# EAGLE design PANOBOT_MAIN_V2 (EAGLE 8.6.3)
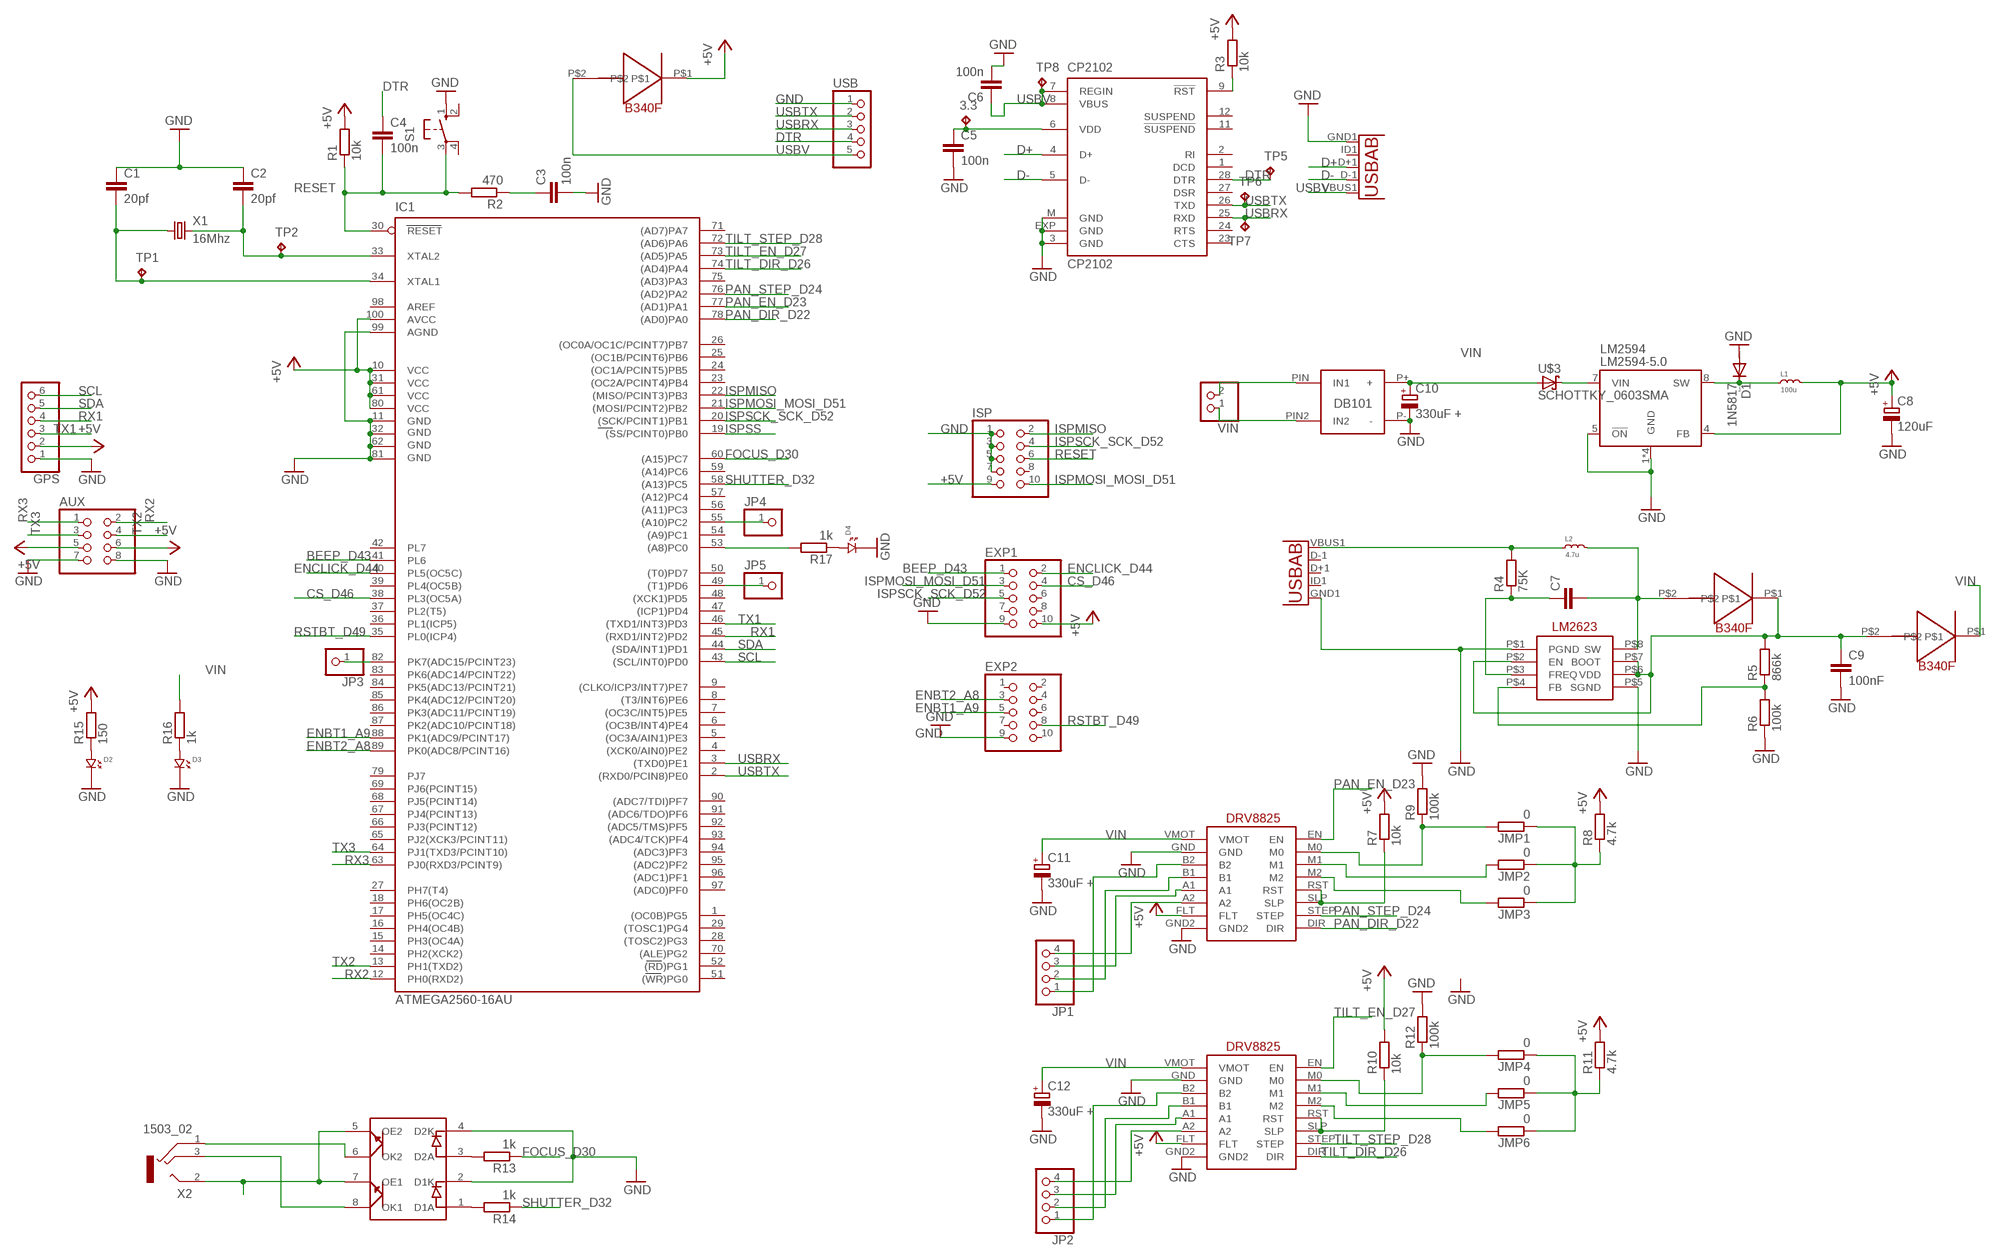
[diagram p0: schematic, sheet 1]

## Parts
3.3  TPTP16R  [TP16R]
AUX  PINHD-2X4  [2X04]
C1  20pf  C-EUC0603K  [C0603K]
C2  20pf  C-EUC0603K  [C0603K]
C3  100n  C-EUC0805  [C0805]
C4  100n  C-EUC0805  [C0805]
C5  100n  C-EUC0805  [C0805]
C6  100n  C-EUC0805  [C0805]
C7  C-EUC0603  [C0603]
C8  120uF  CPOL-EU153CLV-0605  [153CLV-0605]
C9  100nF  C-EU025-030X050  [C025-030X050]
C10  330uF +  CPOL-EUSANYO_F13  [SANYO-OSCON_F13]
C11  330uF +  CPOL-EUSANYO_F13  [SANYO-OSCON_F13]
C12  330uF +  CPOL-EUSANYO_F13  [SANYO-OSCON_F13]
CP2102  CP2102  [MLP28]
D1  1N5817  1N4942  [DO41-10]
D2  LED.0805  [0805.LED]
D3  LED.0805  [0805.LED]
D4  LED.0805  [0805.LED]
EXP1  PINHD-2X5  [2X05]
EXP2  PINHD-2X5  [2X05]
GPS  PINHD-1X6  [1X06]
IC1  ATMEGA2560-16AU  [TQFP100]
ISP  PINHD-2X5  [2X05]
JMP1  0  R-EU_R0805  [R0805]
JMP2  0  R-EU_R0805  [R0805]
JMP3  0  R-EU_R0805  [R0805]
JMP4  0  R-EU_R0805  [R0805]
JMP5  0  R-EU_R0805  [R0805]
JMP6  0  R-EU_R0805  [R0805]
JP1  PINHD-1X4  [1X04]
JP2  PINHD-1X4  [1X04]
JP3  PINHD-1X1  [1X01]
JP4  PINHD-1X1  [1X01]
JP5  PINHD-1X1  [1X01]
L1  100u  RF-INDUCTOR.HP100  [HPINDUCTOR100]
L2  4.7u  RF-INDUCTOR  [HPINDUCOR]
LM2594  LM2594-5.0  [SO08]
LM2623  LM2623  [MINI-SO-8]
R1  10k  R-EU_R0805  [R0805]
R2  470  R-EU_R0805  [R0805]
R3  10k  R-EU_R0805  [R0805]
R4  75K  R-EU_R0805  [R0805]
R5  866k  R-EU_R0805  [R0805]
R6  100k  R-EU_R0805  [R0805]
R7  10k  R-EU_R0805  [R0805]
R8  4.7k  R-EU_R0805  [R0805]
R9  100k  R-EU_R0805  [R0805]
R10  10k  R-EU_R0805  [R0805]
R11  4.7k  R-EU_R0805  [R0805]
R12  100k  R-EU_R0805  [R0805]
R13  1k  R-EU_R0805  [R0805]
R14  1k  R-EU_R0805  [R0805]
R15  150  R-EU_R0805  [R0805]
R16  1k  R-EU_R0805  [R0805]
R17  1k  R-EU_R0805  [R0805]
S1  10-XX  [B3F-10XX]
TP1  TPTP16R  [TP16R]
TP2  TPTP16R  [TP16R]
TP5  TPTP16R  [TP16R]
TP6  TPTP16R  [TP16R]
TP7  TPTP16R  [TP16R]
TP8  TPTP16R  [TP16R]
U1  USB""  [USB-MICRO-SMD]
U2  USB""  [USB-MICRO-SMD]
U$1  B340FSCHOTTKY  [SMC]
U$2  DB101_BRUECKENGLEICHRICHTER  [DB101_PACK]
U$3  SCHOTTKY_0603SMA  [SMA]
U$4  B340FSCHOTTKY  [SMC]
U$5  B340FSCHOTTKY  [SMC]
U$6  DRV8825  [DRV8825POLULOU]
U$7  DRV8825  [DRV8825POLULOU]
U$8  LTV827SMD8  [SMD8]
USB  PINHD-1X5  [1X05]
VIN  PINHD-1X2  [1X02]
X1  16Mhz  CRYSTALS-NOGND-4-HSMX  [HC49-4-HSMX]
X2  1503_02  [1503_02]

## Nets
+5V: AUX.5 AUX.6 C8.+ EXP1.10 GPS.2 IC1.10(VCC) IC1.31(VCC1) IC1.61(VCC2) IC1.80(VCC3) IC1.100(AVCC) ISP.9 L1.P$2 LM2594.4(FB) R1.2 R3.2 R7.2 R8.2 R10.2 R11.2 R15.2 U$1.P$1 U$6.FLT U$7.FLT
+5VUSBPWR: L2.P$1 R4.2 U2.VBUS1(VBUS)
BEEP_D43: EXP1.1 IC1.41(PL6)
CS_D46: EXP1.4 IC1.38(PL3(OC5A))
D+: CP2102.4(D+) U1.D+1(D+)
D-: CP2102.5(D-) U1.D-1(D-)
DTR: C4.1 CP2102.28(DTR) TP5.TP USB.4
ENBT1_A9: EXP2.5 IC1.88(PK1(ADC9/PCINT17))
ENBT2_A8: EXP2.3 IC1.89(PK0(ADC8/PCINT16))
ENCLICK_D44: EXP1.2 IC1.40(PL5(OC5C))
FOCUS_D30: IC1.60((A15)PC7) R13.1
GND: AUX.7 AUX.8 C1.1 C2.1 C3.2 C5.2 C6.2 C8.- C9.2 C10.- C11.- C12.- CP2102.3(GND) CP2102.EXP(GND) CP2102.M(GND) D1.A D2.P$2 D3.P$2 D4.P$2 EXP1.9 EXP2.9 GPS.1 IC1.11(GND) IC1.32(GND1) IC1.62(GND2) IC1.81(GND3) IC1.99(AGND) ISP.1 ISP.3 ISP.5 ISP.7 LM2594.1(GND) LM2594.2(GND) LM2594.3(GND) LM2594.5(!ON!) LM2594.6(GND) LM2623.P$1(PGND) LM2623.P$5(SGND) R6.1 R9.2 R12.2 S1.1(S) U1.GND1(GND) U2.GND1(GND) U$2.P-(-) U$6.GND U$6.GND2 U$7.GND U$7.GND2 U$8.2(D1K) U$8.4(D2K) USB.1
ISPMISO: IC1.22((MISO/PCINT3)PB3) ISP.2
ISPMOSI_MOSI_D51: EXP1.3 IC1.21((MOSI/PCINT2)PB2) ISP.10
ISPSCK_SCK_D52: EXP1.5 IC1.20((SCK/PCINT1)PB1) ISP.4
ISPSS: IC1.19((SS/PCINT0)PB0)
N$1: 3.3.TP C5.1 CP2102.6(VDD)
N$2: CP2102.9(!RST) R3.1
N$3: C3.1 R2.1
N$4: LM2623.P$4(FB) R5.1 R6.2
N$6: C7.1 LM2623.P$3(FREQ) R4.1
N$7: D1.C L1.P$1 LM2594.8(SW)
N$8: JMP1.2 R9.1 U$6.M0
N$9: C7.2 L2.P$2 LM2623.P$8(SW) U$4.P$2
N$10: JMP2.2 U$6.M1
N$11: C9.1 LM2623.P$2(EN) LM2623.P$6(VDD) LM2623.P$7(BOOT) R5.2 U$4.P$1 U$5.P$2
N$12: JMP3.2 U$6.M2
N$13: JMP1.1 JMP2.1 JMP3.1 R8.1
N$14: JP1.1 U$6.B2
N$15: JP1.2 U$6.B1
N$16: JP1.3 U$6.A1
N$17: JP1.4 U$6.A2
N$19: JMP4.2 R12.1 U$7.M0
N$20: JMP5.2 U$7.M1
N$21: JMP6.2 U$7.M2
N$22: JMP4.1 JMP5.1 JMP6.1 R11.1
N$23: JP2.1 U$7.B2
N$24: JP2.2 U$7.B1
N$25: JP2.3 U$7.A1
N$26: JP2.4 U$7.A2
N$27: R13.2 U$8.3(D2A)
N$28: R14.2 U$8.1(D1A)
N$29: U$8.6(OK2) X2.1
N$30: U$8.8(OK1) X2.3
N$31: U$8.5(OE2) U$8.7(OE1) X2.2
N$32: U$2.PIN(IN1) VIN.2
N$33: U$2.PIN2(IN2) VIN.1
N$34: IC1.82(PK7(ADC15/PCINT23)) JP3.1
N$35: IC1.55((A10)PC2) JP4.1
N$36: IC1.49((T1)PD6) JP5.1
N$37: D2.P$1 R15.1
N$38: D3.P$1 R16.1
N$39: D4.P$1 R17.1
N$40: IC1.53((A8)PC0) R17.2
N$41: LM2594.7(VIN) U$3.P$1(C)
PAN_DIR_D22: IC1.78((AD0)PA0) U$6.DIR
PAN_EN_D23: IC1.77((AD1)PA1) U$6.EN
PAN_STEP_D24: IC1.76((AD2)PA2) U$6.STEP
RESET: C4.2 IC1.30(RESET) ISP.6 R1.1 R2.2 S1.3(P)
RESET1: R7.1 U$6.RST U$6.SLP
RESET2: R10.1 U$7.RST U$7.SLP
RSTBT_D49: EXP2.8 IC1.35(PL0(ICP4))
RX1: GPS.4 IC1.45((RXD1/INT2)PD2)
RX2: AUX.2 IC1.12(PH0(RXD2))
RX3: AUX.1 IC1.63(PJ0(RXD3/PCINT9))
SCL: GPS.6 IC1.43((SCL/INT0)PD0)
SDA: GPS.5 IC1.44((SDA/INT1)PD1)
SHUTTER_D32: IC1.58((A13)PC5) R14.1
TILT_DIR_D26: IC1.74((AD4)PA4) U$7.DIR
TILT_EN_D27: IC1.73((AD5)PA5) U$7.EN
TILT_STEP_D28: IC1.72((AD6)PA6) U$7.STEP
TX1: GPS.3 IC1.46((TXD1/INT3)PD3)
TX2: AUX.4 IC1.13(PH1(TXD2))
TX3: AUX.3 IC1.64(PJ1(TXD3/PCINT10))
USBRX: CP2102.25(RXD) IC1.3((TXD0)PE1) TP7.TP USB.3
USBTX: CP2102.26(TXD) IC1.2((RXD0/PCIN8)PE0) TP6.TP USB.2
USBV: C6.1 CP2102.7(REGIN) CP2102.8(VBUS) TP8.TP U1.VBUS1(VBUS) U$1.P$2 USB.5
VIN: C10.+ C11.+ C12.+ R16.2 U$2.P+(+) U$3.P$2(A) U$5.P$1 U$6.VMOT U$7.VMOT
XTAL1: C1.2 IC1.34(XTAL1) TP1.TP X1.1
XTAL2: C2.2 IC1.33(XTAL2) TP2.TP X1.2
Unconnected: CP2102.1(DCD) CP2102.2(RI) CP2102.11(!SUSPEND) CP2102.12(SUSPEND) CP2102.23(CTS) CP2102.24(RTS) CP2102.27(DSR) EXP1.6 EXP1.7 EXP1.8 EXP2.1 EXP2.2 EXP2.4 EXP2.6 EXP2.7 EXP2.10 IC1.1((OC0B)PG5) IC1.4((XCK0/AIN0)PE2) IC1.5((OC3A/AIN1)PE3) IC1.6((OC3B/INT4)PE4) IC1.7((OC3C/INT5)PE5) IC1.8((T3/INT6)PE6) IC1.9((CLKO/ICP3/INT7)PE7) IC1.14(PH2(XCK2)) IC1.15(PH3(OC4A)) IC1.16(PH4(OC4B)) IC1.17(PH5(OC4C)) IC1.18(PH6(OC2B)) IC1.23((OC2A/PCINT4)PB4) IC1.24((OC1A/PCINT5)PB5) IC1.25((OC1B/PCINT6)PB6) IC1.26((OC0A/OC1C/PCINT7)PB7) IC1.27(PH7(T4)) IC1.28((TOSC2)PG3) IC1.29((TOSC1)PG4) IC1.36(PL1(ICP5)) IC1.37(PL2(T5)) IC1.39(PL4(OC5B)) IC1.42(PL7) IC1.47((ICP1)PD4) IC1.48((XCK1)PD5) IC1.50((T0)PD7) IC1.51((WR)PG0) IC1.52((RD)PG1) IC1.54((A9)PC1) IC1.56((A11)PC3) IC1.57((A12)PC4) IC1.59((A14)PC6) IC1.65(PJ2(XCK3/PCINT11)) IC1.66(PJ3(PCINT12)) IC1.67(PJ4(PCINT13)) IC1.68(PJ5(PCINT14)) IC1.69(PJ6(PCINT15)) IC1.70((ALE)PG2) IC1.71((AD7)PA7) IC1.75((AD3)PA3) IC1.79(PJ7) IC1.83(PK6(ADC14/PCINT22)) IC1.84(PK5(ADC13/PCINT21)) IC1.85(PK4(ADC12/PCINT20)) IC1.86(PK3(ADC11/PCINT19)) IC1.87(PK2(ADC10/PCINT18)) IC1.90((ADC7/TDI)PF7) IC1.91((ADC6/TDO)PF6) IC1.92((ADC5/TMS)PF5) IC1.93((ADC4/TCK)PF4) IC1.94((ADC3)PF3) IC1.95((ADC2)PF2) IC1.96((ADC1)PF1) IC1.97((ADC0)PF0) IC1.98(AREF) ISP.8 S1.2(S1) S1.4(P1) U1.ID1(USBID) U2.D+1(D+) U2.D-1(D-) U2.ID1(USBID) X2.2@2

## Library data of the parts
3.3 TP1 TP2 TP5-TP8 = testpad:TP: Test pad
AUX = pinhead:PINHD-2X4: PIN HEADER
C1-C7 C9 = rcl:C-EU: CAPACITOR, European symbol; SPICEPREFIX: C
C8 C10-C12 = rcl:CPOL-EU: POLARIZED CAPACITOR, European symbol; SPICEPREFIX: C
CP2102 = silabs:CP210*: Single-Chip USB to UART Bridge Source: www.silabs.com .. CP2101.pdf / cp2102.pdf; MF: FARNELL; MPN: CP2102-GM; OC_FARNELL: 9282130; OC_NEWARK: 30K5635
D1 = diode:1N4942: DIODE 1.0 A, 200 V, 150 ns
D2-D4 = standardparts:LED
EXP1 EXP2 ISP = pinhead:PINHD-2X5: PIN HEADER
GPS = pinhead:PINHD-1X6: PIN HEADER
IC1 = atmel-2005:ATMEGA*: MICROCONTROLLER 64/128/256 Kbytes FLASH 4 Kbytes EEPROM 8 Kbytes SRAM 86 General Purpose I/O pins 12-channels16-bit PWM 4 x Serial USARTs 16-channels 10-bit A/D
JMP1-JMP6 R1-R17 = rcl:R-EU_: RESISTOR, European symbol; SPICEPREFIX: R
JP1 JP2 = pinhead:PINHD-1X4: PIN HEADER
JP3-JP5 = pinhead:PINHD-1X1: PIN HEADER
L1 L2 = standardparts:RF-INDUCTOR
LM2594 = we-power:LM2594: TI LM2594 Step-Down (150kHz, 0.5A, 4.5-45V input)
LM2623 = 00_eigene:LM2623
S1 = switch-omron:10-XX: OMRON SWITCH; MPN: B3F-1000; OC_FARNELL: 176432; OC_NEWARK: 36M3542
U1 U2 = MicroUSB:USB: This is a USB AB connector that is compatible with USB OTG. i.e. this connector can serve as a host or device
U$1 U$4 U$5 = 00_eigene:B340FSCHOTTKY
U$2 = 00_eigene:DB101_BRUECKENGLEICHRICHTER
U$3 = 00_eigene:SCHOTTKY_0603
U$6 U$7 = 00_eigene:DRV8825
U$8 = 00_eigene:LTV827; SPICEPREFIX: X
USB = pinhead:PINHD-1X5: PIN HEADER
VIN = pinhead:PINHD-1X2: PIN HEADER
X1 = IQD-Frequency-Products:CRYSTALS-NOGND: CRYSTALS CAN NOT GROUNDED
X2 = con-lumberg:1503_02: Jack connectors according to JISC 6560, 3.5 mm Klinkeneinbaukupplung nach JISC 6560, 3,5 mm, 3-polig/stereo, abgewinkelte Ausführung, Surface-Mount-Technik (SMT) Source: http://www.lumberg.com/Produkte/PDFs/1503_02.pdf; OC_FARNELL: 1216979; OC_NEWARK: unknown

## Board
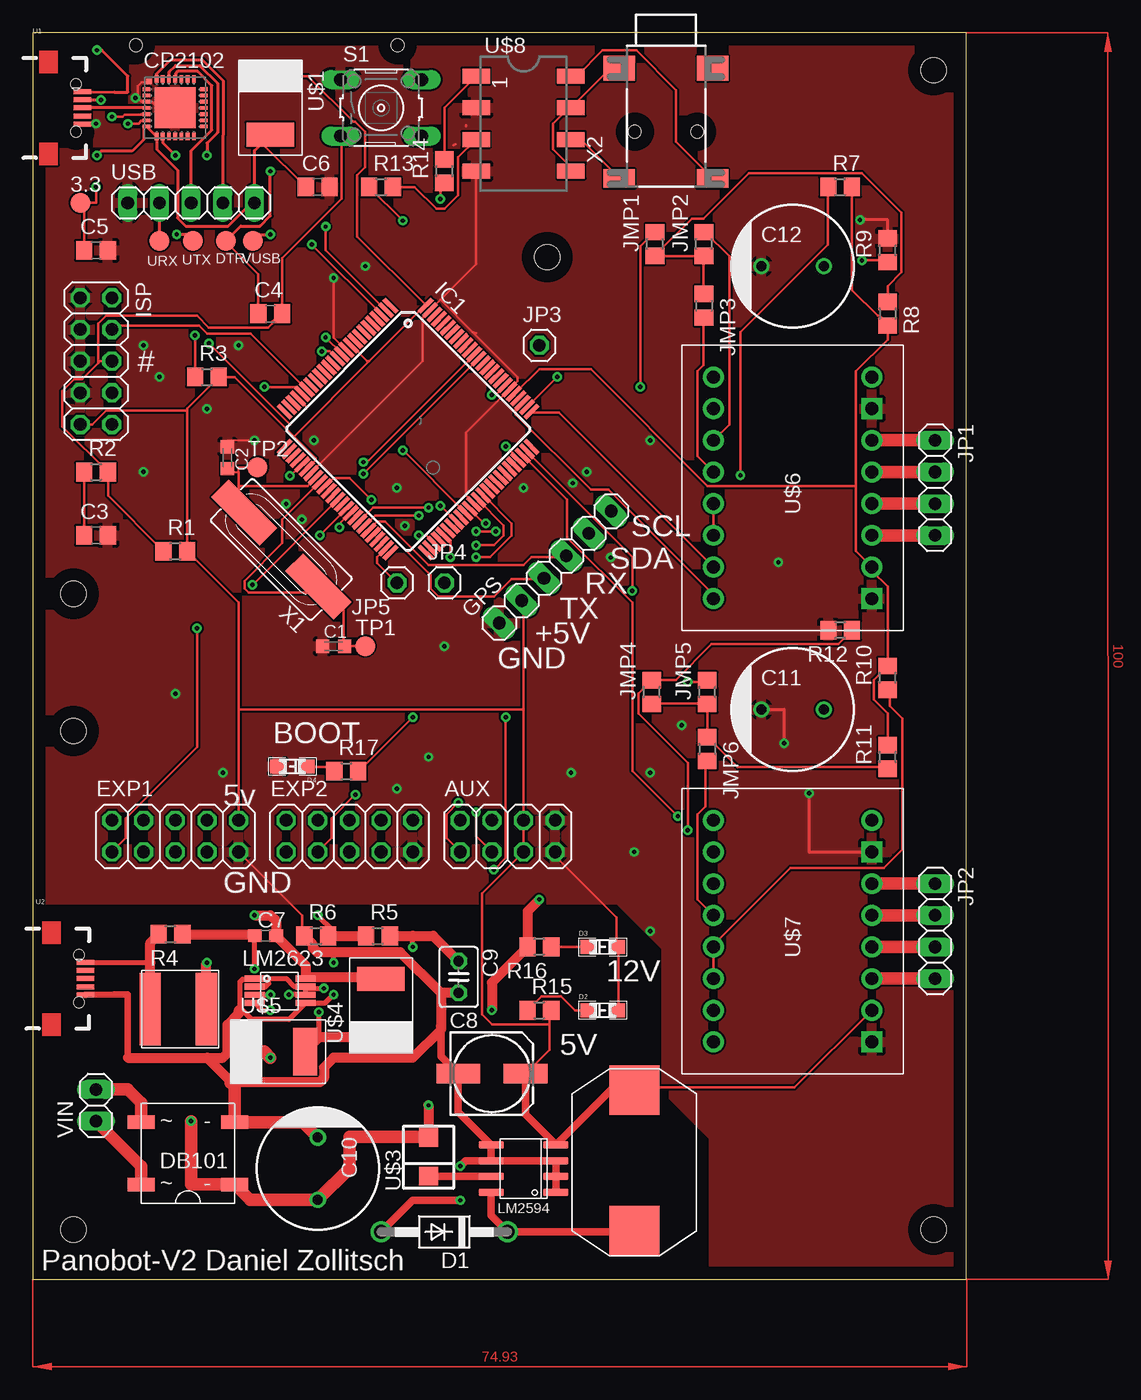
[diagram p1: board, top side]
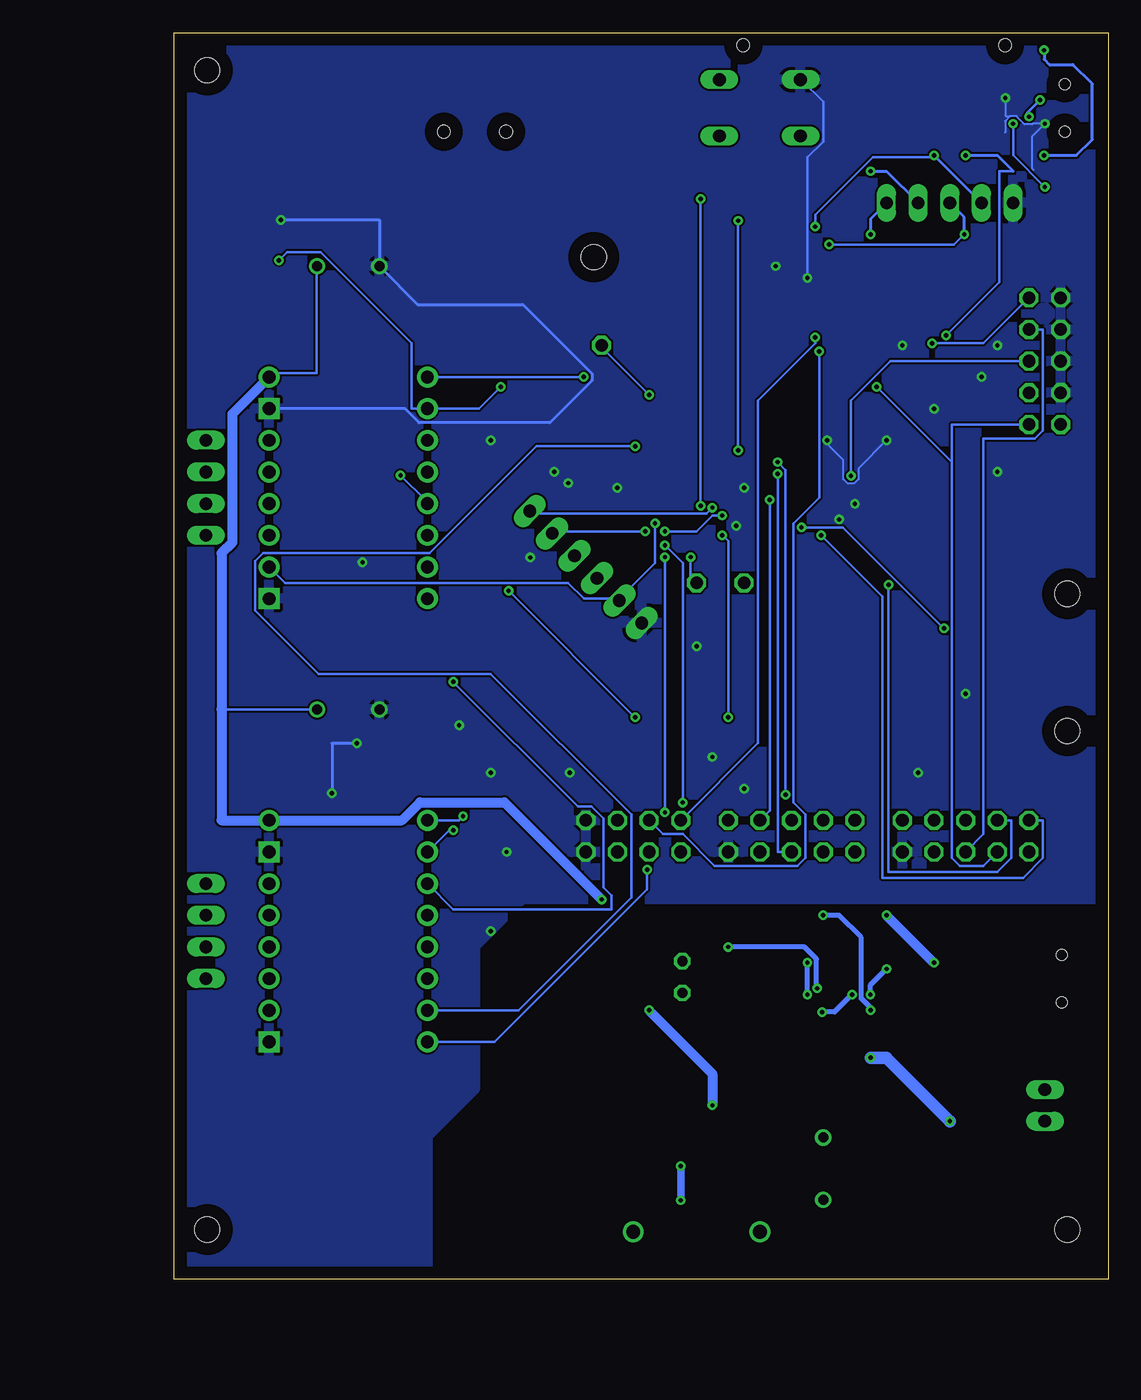
[diagram p2: board, bottom side, seen from below]

Size 74.91 x 100 mm. Coordinates in mm from the lower left corner, seen from the top.
Outline: 0,0 74.91,0 74.91,100 0,100 0,0
Copper layers (1*16): Top 0.035mm / dielectric 1.5mm / Bottom 0.035mm
Design rules "default *": minimum track width 8mil, minimum drill 0.35mm, track to track 6mil, track to pad 6mil, pad to pad 6mil, via to via 6mil, smd to smd 6mil, copper to edge 40mil, drill to drill 6mil, minimum pad ring 10mil, minimum via ring 8mil, stop-mask expansion 4mil, vias tented up to drill 0mil, thermal gap 10mil
Holes 2 mm at 3.27,55 3.27,44 3.27,4 72.27,4 72.27,97 41.27,82
Holes 1 mm at 8.27,99 29.27,99

### Footprints (pad centres in the part's own frame; a part is rotated, then mirrored left to right if it is on the bottom)
TP16R = smd 1.6 x 1.6: TP 0,0
2X04 = drill 1.016 octagon: 1 -3.81,-1.27; 2 -3.81,1.27; 3 -1.27,-1.27; 4 -1.27,1.27; 5 1.27,-1.27; 6 1.27,1.27; 7 3.81,-1.27; 8 3.81,1.27
C0603K = smd 1.05 x 1.08: 1 -0.875,0; 2 0.875,0
C0805 = smd 1.3 x 1.5: 1 -0.95,0; 2 0.95,0
C0603 = smd 1.1 x 1: 1 -0.85,0; 2 0.85,0
153CLV-0605 = smd 3.5 x 1.6: + 2.7,0; - -2.7,0
C025-030X050 = drill 0.813 octagon: 1 -1.27,0; 2 1.27,0
SANYO-OSCON_F13 = drill 0.8 pad 1.27: + 2.5,0; - -2.5,0
MLP28 = smd 0.6 x 0.3: 1 -2.3,1.5; 2 -2.3,1; 3 -2.3,0.5; 4 -2.3,0; 5 -2.3,-0.5; 6 -2.3,-1; 7 -2.3,-1.5; 15 2.3,-1.5; 16 2.3,-1; 17 2.3,-0.5; 18 2.3,0; 19 2.3,0.5; 20 2.3,1; 21 2.3,1.5 | smd 0.3 x 0.6: 8 -1.5,-2.3; 9 -1,-2.3; 10 -0.5,-2.3; 11 0,-2.3; 12 0.5,-2.3; 13 1,-2.3; 14 1.5,-2.3; 22 1.5,2.3; 23 1,2.3; 24 0.5,2.3; 25 0,2.3; 26 -0.5,2.3; 27 -1,2.3; 28 -1.5,2.3 | smd 3.3 x 3.3: EXP 0,0 | smd 0.435 x 0.435: M -2.103,2.103
DO41-10 = drill 1.118: A 5.08,0; C -5.08,0
0805.LED = smd 1.25 x 1.1: P$1 -1.175,0; P$2 1.175,0
2X05 = drill 1.016 octagon: 1 -5.08,-1.27; 2 -5.08,1.27; 3 -2.54,-1.27; 4 -2.54,1.27; 5 0,-1.27; 6 0,1.27; 7 2.54,-1.27; 8 2.54,1.27; 9 5.08,-1.27; 10 5.08,1.27
1X06 = drill 1.016 long: 1 -6.35,0; 2 -3.81,0; 3 -1.27,0; 4 1.27,0; 5 3.81,0; 6 6.35,0
TQFP100 = smd 1.5 x 0.35: 1 -8,6; 2 -8,5.5; 3 -8,5; 4 -8,4.5; 5 -8,4; 6 -8,3.5; 7 -8,3; 8 -8,2.5; 9 -8,2; 10 -8,1.5; 11 -8,1; 12 -8,0.5; 13 -8,0; 14 -8,-0.5; 15 -8,-1; 16 -8,-1.5; 17 -8,-2; 18 -8,-2.5; 19 -8,-3; 20 -8,-3.5; 21 -8,-4; 22 -8,-4.5; 23 -8,-5; 24 -8,-5.5; 25 -8,-6; 51 8,-6; 52 8,-5.5; 53 8,-5; 54 8,-4.5; 55 8,-4; 56 8,-3.5; 57 8,-3; 58 8,-2.5; 59 8,-2; 60 8,-1.5; 61 8,-1; 62 8,-0.5; 63 8,0; 64 8,0.5; 65 8,1; 66 8,1.5; 67 8,2; 68 8,2.5; 69 8,3; 70 8,3.5; 71 8,4; 72 8,4.5; 73 8,5; 74 8,5.5; 75 8,6 | smd 0.35 x 1.5: 26 -6,-8; 27 -5.5,-8; 28 -5,-8; 29 -4.5,-8; 30 -4,-8; 31 -3.5,-8; 32 -3,-8; 33 -2.5,-8; 34 -2,-8; 35 -1.5,-8; 36 -1,-8; 37 -0.5,-8; 38 0,-8; 39 0.5,-8; 40 1,-8; 41 1.5,-8; 42 2,-8; 43 2.5,-8; 44 3,-8; 45 3.5,-8; 46 4,-8; 47 4.5,-8; 48 5,-8; 49 5.5,-8; 50 6,-8; 76 6,8; 77 5.5,8; 78 5,8; 79 4.5,8; 80 4,8; 81 3.5,8; 82 3,8; 83 2.5,8; 84 2,8; 85 1.5,8; 86 1,8; 87 0.5,8; 88 0,8; 89 -0.5,8; 90 -1,8; 91 -1.5,8; 92 -2,8; 93 -2.5,8; 94 -3,8; 95 -3.5,8; 96 -4,8; 97 -4.5,8; 98 -5,8; 99 -5.5,8; 100 -6,8
R0805 = smd 1.3 x 1.5: 1 -0.95,0; 2 0.95,0
1X04 = drill 1.016 long: 1 -3.81,0; 2 -1.27,0; 3 1.27,0; 4 3.81,0
1X01 = drill 1.016 octagon: 1 0,0
HPINDUCTOR100 = smd 4 x 4: P$1 0,-5; P$2 0,6.3
HPINDUCOR = smd 1.7 x 5.8: P$1 1.5,-0.1; P$2 -3,-0.1
SO08 = smd 2 x 0.6: 1 -2.6,1.905; 2 -2.6,0.635; 3 -2.6,-0.635; 4 -2.6,-1.905; 5 2.6,-1.905; 6 2.6,-0.635; 7 2.6,0.635; 8 2.6,1.905
MINI-SO-8 = smd 1.6 x 0.5: P$1 0,0; P$2 0,-0.65; P$3 0,-1.3; P$4 0,-1.95; P$5 4.1,-1.95; P$6 4.1,-1.3; P$7 4.1,-0.65; P$8 4.1,0
B3F-10XX = drill 1.016 long: 1 -3.251,2.261; 2 3.251,2.261; 3 -3.251,-2.261; 4 3.251,-2.261
USB-MICRO-SMD = smd 1.4 x 0.4: D+1 2.7,0; D-1 2.7,0.65; GND1 2.7,-1.3; ID1 2.7,-0.65; VBUS1 2.7,1.3 | hole 0.85: 2.2,1.9; 2.2,-1.9
SMC = smd 1.93 x 3.81: P$1 0,0; P$2 4.69,0
DB101_PACK = smd 2.184 x 1.067: P+ 3.5,0; P- 3.5,5; PIN -4,5; PIN2 -4,0
SMA = smd 1.5 x 1.5: P$1 -3,0; P$2 0.1,0
DRV8825POLULOU = drill 1.02 pad 1.676: A1 12.7,-10.16; A2 12.7,-12.7; B1 12.7,-7.62; B2 12.7,-5.08; DIR 0,-17.78; EN 0,0; FLT 12.7,-15.24; M0 0,-2.54; M1 0,-5.08; M2 0,-7.62; RST 0,-10.16; SLP 0,-12.7; STEP 0,-15.24; VMOT 12.7,0 | drill 1.02 pad 1.676 square: GND 12.7,-2.54; GND2 12.7,-17.78
SMD8 = smd 1.2 x 2.2: 1 -2.54,-3.8; 2 0,-3.8; 3 2.54,-3.8; 4 5.08,-3.8; 5 5.08,3.8; 6 2.54,3.8; 7 0,3.8; 8 -2.54,3.8
1X05 = drill 1.016 long: 1 -5.08,0; 2 -2.54,0; 3 0,0; 4 2.54,0; 5 5.08,0
1X02 = drill 1.016 long: 1 -1.27,0; 2 1.27,0
HC49-4-HSMX = smd 5.5 x 2: 1 -4.2,0; 2 4.2,0
1503_02 = smd 2.5 x 1.5: 1 -3.75,-10.75; 3 3.75,-10.75 | smd 2.5 x 2: 2 -3.75,-1.9; 2@2 3.75,-1.9 | hole 1: -2.5,-7; 2.5,-7

### Placement (x,y rotation side)
3.3  3.81,86.36 0 top
AUX  38.1,35.56 0 top
C1  24.13,50.8 0 top
C2  15.62,65.91 270 top
C3  5.08,59.69 0 top
C4  19.05,77.47 0 top
C5  5.08,82.55 0 top
C6  22.86,87.63 0 top
C7  18.67,27.56 0 top
C8  36.83,16.51 0 top
C9  34.16,24.26 270 top
C10  22.86,8.89 270 top
C11  60.96,45.72 0 top
C12  60.96,81.28 0 top
CP2102  11.43,93.98 0 top
D1  33.02,3.81 180 top
D2  45.72,21.59 0 top
D3  45.72,26.67 0 top
D4  20.83,41.15 180 top
EXP1  11.43,35.56 0 top
EXP2  25.4,35.56 0 top
GPS  41.91,57.15 45 top
IC1  30.11,68.21 315 top
ISP  5.08,73.66 270 top
JMP1  49.91,83.06 90 top
JMP2  53.85,83.06 90 top
JMP3  53.85,78.11 270 top
JMP4  49.66,47.12 90 top
JMP5  54.1,47.12 90 top
JMP6  54.1,42.55 270 top
JP1  72.39,63.5 270 top
JP2  72.39,27.94 270 top
JP3  40.64,74.93 0 top
JP4  33.02,55.88 0 top
JP5  29.21,55.88 0 top
L1  48.26,8.89 0 top
L2  10.92,21.59 180 top
LM2594  39.37,8.89 180 top
LM2623  17.78,24.13 0 top
R1  11.43,58.42 0 top
R2  5.08,64.77 0 top
R3  13.97,72.39 0 top
R4  11.05,27.69 180 top
R5  27.69,27.56 0 top
R6  22.73,27.56 0 top
R7  64.77,87.63 0 top
R8  68.58,77.47 270 top
R9  68.58,82.55 90 top
R10  68.58,48.26 90 top
R11  68.58,41.91 90 top
R12  64.77,52.07 180 top
R13  27.94,87.63 0 top
R14  33.02,88.9 90 top
R15  40.64,21.59 0 top
R16  40.64,26.67 180 top
R17  25.15,40.77 0 top
S1  27.94,93.98 0 top
TP1  26.67,50.8 0 top
TP2  18.03,65.15 0 top
TP5  15.49,83.31 180 top
TP6  10.16,83.31 180 top
TP7  12.83,83.31 180 top
TP8  17.65,83.31 180 top
U1  1.27,93.98 0 top
U2  1.51,24.13 0 top
U$1  19.05,96.52 270 top
U$2  12.7,7.62 0 top
U$3  31.75,11.3 90 top
U$4  27.94,19.43 90 top
U$5  17.14,18.29 0 top
U$6  54.61,72.39 0 top
U$7  54.61,36.83 0 top
U$8  39.37,93.98 270 top
USB  12.7,86.36 0 top
VIN  5.08,13.97 90 top
X1  19.94,58.55 135 top
X2  50.8,99.06 0 top

### Tracks (layer width: path | path; a pad name or v marks a point on that pad's centre or on a via)
+5V  (via drill 0.35)
  Top 0.203: R7.2 65.72,79.38 67.79,77.31 67.94,77.31 68.58,76.68 R8.2 68.58,75.41 66.04,72.87 66.04,63.66 | R11.2 68.58,45.4 67.47,46.51 67.47,48.1 R10.2 | R10.2 68.58,55.56 67.31,56.83 U$6.FLT 66.04,58.42 66.04,63.66 | R10.2 | 41.43,20.48 41.43,18.41 39.69,16.67 C8.+ | 41.43,20.48 41.43,21.59 R15.2 | U$7.FLT 61.12,15.4 48.42,15.4 L1.P$2 | 39.37,45.72 AUX.6 AUX.5 36.04,30.96 36.04,21.27 36.83,20.48 41.43,20.48 | 39.37,45.72 39.37,54.45 GPS.2 | 12.38,69.69 12.38,69.85 R3.2 | 12.38,69.69 R1.2 | 20.95,67.63 16.19,72.39 R3.2 | 20.95,67.63 22.7,65.88 22.7,65.72 22.07,65.09 IC1.31 | R3.2 | 20.95,67.63 26.99,73.66 | 26.99,73.66 31.43,78.11 IC1.100 31.43,78.26 26.04,83.66 26.04,88.58 26.67,89.22 26.67,92.08 25.88,92.87 25.72,92.87 22.07,96.52 U$1.P$1 | 16.51,45.72 16.51,54.29 R1.2 | 16.51,45.72 EXP1.10 | R1.2 | ISP.9 4.76,68.58 5.87,69.69 12.38,69.69 | 16.51,45.72 39.37,45.72 | v36.35,60.64 36.2,60.64 35.08,61.75 IC1.61 | 66.04,63.66 54.13,63.66 44.77,73.03 40.64,73.03 38.74,71.12 IC1.80 | 26.99,73.66 26.83,73.66 25.56,74.93 IC1.10
  Top 0.61: C8.+ 39.53,13.23 LM2594.4 46.37,15.19 L1.P$2
  Bottom 0.203: U$6.FLT 66.04,55.88 43.34,55.88 42.07,54.61 39.37,54.61 GPS.2 39.21,54.61 36.35,57.47 v36.35,60.64
+5VUSBPWR
  Top 0.406: U2.VBUS1 9.39,25.43 9.42,25.4
  Top 0.813: L2.P$1 9.42,25.4 9.42,27.01 R4.2
BEEP_D43  (via drill 0.35)
  Top 0.203: v24.61,60.33 24.61,60.64 25.4,61.44 IC1.41 | v13.18,52.23 13.18,42.7 7.46,36.99 7.46,35.4 EXP1.1
  Bottom 0.203: v24.61,60.33 21.27,60.33 v13.18,52.23
CS_D46  (via drill 0.35)
  Top 0.203: v17.62,55.72 IC1.38
  Bottom 0.203: v17.62,55.72 17.62,32.7 8.89,32.7 7.78,33.81 7.78,36.83 EXP1.4
D+
  Top 0.254: CP2102.4 U1.D+1
D-  (via drill 0.35)
  Top 0.203: v6.35,93.27 7.22,93.27 7.38,93.44 9.09,93.44 CP2102.5
  Top 0.254: U1.D-1 5.45,94.63 v5.46,94.61 | 8.69,93.46 9.11,93.46 CP2102.5
  Bottom 0.254: v5.46,94.61 6.48,93.6 6.48,93.47 6.35,93.34 v6.35,93.27
DTR  (via drill 0.35)
  Top 0.203: C4.1 18.1,80.64 15.56,83.19 TP5.TP
  Top 0.254: CP2102.28 9.95,96.3 9.95,96.72 11.06,97.83 13.6,97.83 15.28,96.15 15.28,91.81 15.24,91.78 USB.4 | TP5.TP 16.69,84.51 18.23,84.51 19.05,85.32 v19.05,88.9
  Bottom 0.254: v19.05,88.9 17.78,88.9 USB.4
ENBT1_A9  (via drill 0.35)
  Top 0.203: v26.51,64.61 IC1.88
  Bottom 0.203: v26.51,64.61 26.51,34.29 EXP2.5
ENBT2_A8  (via drill 0.35)
  Top 0.203: v26.51,65.56 26.83,65.56 35.4,74.14 IC1.89 | v25.88,38.89 23.97,36.99 23.97,35.4 EXP2.3
  Bottom 0.203: v26.51,65.56 25.88,64.93 v25.88,38.89
ENCLICK_D44  (via drill 0.35)
  Top 0.203: v23.02,59.69 25.08,61.75 IC1.40
  Bottom 0.203: v23.02,59.69 18.1,54.77 18.1,32.23 6.83,32.23 5.24,33.81 5.24,36.83 EXP1.2
FOCUS_D30  (via drill 0.35)
  Top 0.203: v29.69,66.52 34.61,61.59 IC1.60 | v29.69,84.93 R13.1
  Bottom 0.203: v29.69,84.93 v29.69,66.52
GND  (via drill 0.35)
  Top 0.152: C2.1 15.62,67.31 v17.78,67.31
  Top 0.203: 16.2,15.43 16.19,15.56 15.95,15.82 | IC1.62 35.4,62.23 34.77,62.87 34.77,67.94 38.1,71.28 IC1.81 38.26,71.44 38.89,72.07 38.89,72.39 35.28,76.01 | D2.P$2 46.99,21.59 46.99,26.67 D3.P$2 46.83,26.67 46.83,29.05 41.91,33.97 AUX.7 41.91,34.45 | CP2102.M 9.21,96.04 8.73,96.04 8.41,95.73 8.41,94.77 8.73,94.46 9.05,94.46 CP2102.3 | 32.7,78.58 35.56,81.44 U$8.4 | 32.7,78.58 31.91,77.79 IC1.99 31.75,77.63 31.27,77.15 31.27,73.66 22.38,64.77 IC1.32 | 32.7,78.58 35.28,76.01 | EXP1.9 21.59,29.21 21.59,27.94 R6.1 | v24.13,80.33 24.13,75.56 25.08,74.61 IC1.11 | 33.77,91 33.91,91.06 | 35.28,76.01 35.27,76 35.56,75.92 | 34.77,92.5 34.77,92.6
  Top 0.254: CP2102.3 9.15,94.46 9.57,94.46 10.05,93.98 CP2102.EXP | U1.GND1 4,92.71 v5.08,92.71 | 8.41,94.77 v8.25,94.77 | R9.2 68.58,85 v66.35,85 | C11.- 60.27,45.72 v60.27,43 | v62.27,39 62.27,34.29 U$7.GND
  Top 0.406: v24.13,22.86 23.45,22.18 LM2623.P$5 20.56,20.86 17.55,20.86 16.62,21.78 16.62,23.88 16.83,24.09 17.74,24.09 LM2623.P$1 | v24.13,25.4 24.13,26.25
  Top 0.508: U2.GND1 6.54,22.86 7.62,22.86 7.62,17.78
  Top 0.61: LM2594.6 LM2594.3 LM2594.2 LM2594.1 | LM2594.6 LM2594.5 34.13,13.44 C8.- 32.73,17.91 32.73,20.32 | D1.A 30.48,6.35 v34.29,6.35 | v34.29,9.09 34.73,9.53 LM2594.6
  Top 0.813: R6.1 22.47,26.87 22.47,26.58 22.8,26.25 24.13,26.25 29.47,26.25 32.73,22.99 | C9.2 32.73,22.99 | 7.62,17.78 13.99,17.78 | 13.99,17.78 15.24,17.78 15.62,18.16 15.62,20.42 16.52,21.32 16.52,21.6 | 32.73,22.99 32.73,20.32 32.73,20.03 30.48,17.78 24.13,17.78 23.36,17.01 23.36,16.15 23.03,15.82 15.95,15.82 13.99,17.78
  Top 1.016: 15.88,15.75 16.2,15.43 U$2.P- 21.63,12.62 C10.-
  Bottom 0.152: v17.78,67.31 20.03,65.06 20.03,64.2 20.39,63.85 20.89,63.85 21.24,64.2 21.24,65.71 22.85,67.31 v22.54,67.31 | 5.98,89 6.13,89.14 6.13,91.66 v5.08,92.71 6.05,92.71 6.1,92.67 6.72,92.67 7.37,93.32 7.87,93.32 | 7.87,93.32 8.27,92.92 8.27,92 | v8.25,94.77 8.25,93.32 7.87,93.32
  Bottom 0.203: v24.13,80.33 24.13,90.01 22.86,91.28 22.86,94.46 24.61,96.2 S1.1
  Bottom 0.254: v66.35,85 58.46,85 C12.- 55.39,78.21 46.96,78.21 41.41,72.66 41.41,72.12 44.8,68.73 55.3,68.73 56.42,69.85 U$6.GND | v60.27,43 62.27,43 v62.27,39
  Bottom 0.406: v24.13,22.86 v24.13,25.4
  Bottom 0.61: v34.29,6.35 v34.29,9.09
  other vias: 15.24,40.64 31.75,41.91 33.02,50.8 8.89,64.77 49.53,67.31 11.43,46.99 48.26,34.29 29.21,63.5 39.37,63.5 44.45,64.77 52.07,44.45 49.53,40.64 29.21,39.37 49.53,27.94 16.51,74.93 26.67,81.28 13.97,69.85 10.16,72.39 8.89,74.93 20.32,62.23 21.59,60.96 29.84,60.45 46.36,57.91 43.31,63.88 59.82,57.53 43.18,40.64
  pour Top: 0,30.48 46.99,30.48 48.26,29.21 50.8,26.67 50.8,16.51 50.8,15.24 54.61,11.43 54.61,0 74.93,0 74.93,100.33 -1.27,100.33 -1.27,30.48
  pour Bottom: 0,30.48 46.99,30.48 48.26,29.21 50.8,26.67 50.8,16.51 50.8,15.24 54.61,11.43 54.61,0 74.93,0 74.93,100.33 -1.27,100.33 -1.27,30.48
ISPMISO  (via drill 0.35)
  Top 0.203: v14.13,75.09 20.64,68.58 21.91,69.85 21.91,70.01 21.27,70.64 IC1.22
  Bottom 0.203: v14.13,75.09 10,75.09 ISP.2
ISPMOSI_MOSI_D51  (via drill 0.35)
  Top 0.203: v18.57,71.6 21.11,71.6 21.59,71.12 IC1.21
  Bottom 0.203: EXP1.3 10,33.18 11.91,33.18 12.54,33.81 12.54,65.56 | 12.54,65.56 12.54,68.58 ISP.10 | 12.54,65.56 v18.57,71.6
ISPSCK_SCK_D52
  Top 0.203: ISP.4 6.67,76.52 13.33,76.52 13.97,75.88 17.46,75.88 21.91,71.44 IC1.20
  Bottom 0.203: EXP1.5 10,35.72 10,67.47 5.87,67.47 5.24,68.1 5.24,76.2 ISP.4
N$1  (via drill 0.35)
  Top 0.203: C5.1 4.13,86.04 3.3.TP 5.08,86.36 v5.08,87.63 | CP2102.6 9.09,92.94 8.7,92.94 8.48,92.71 v7.62,92.71
  Top 0.254: CP2102.6 9.11,92.96 8.89,92.96
  Bottom 0.203: v7.62,92.71 7.62,90.17 v5.08,87.63
N$2  (via drill 0.35)
  Top 0.203: v13.02,75.72 R3.1
  Top 0.254: CP2102.9 10.43,91.17 v11.43,90.17
  Bottom 0.203: v13.02,75.72 8.73,80.01 8.73,88.9 7.78,88.9 7.7,88.98
  Bottom 0.254: v11.43,90.17 8.89,90.17 7.7,88.98 7.62,88.9
N$3
  Top 0.203: C3.1 R2.1
N$4  (via drill 0.35)
  Top 0.406: LM2623.P$4 18.37,21.59 v19.05,21.59 | v22.86,29.21 24.13,27.94 23.75,27.56 R6.2
  Top 0.813: R6.2 R5.1
  Bottom 0.406: v19.05,21.59 19.05,21.77 19.81,22.53 19.81,27.43 21.59,29.21 v22.86,29.21
N$6  (via drill 0.35)
  Top 0.406: LM2623.P$3 v19.07,22.83 v19.07,22.84 | v17.78,24.91 17.78,27.52 C7.1
  Top 0.813: R4.1 17.69,27.69 C7.1
  Bottom 0.406: v19.07,22.84 19.07,23.61 v17.78,24.91
N$7
  Top 0.61: LM2594.8 36.77,5.14 D1.C 48.18,3.81 L1.P$1
N$8  (via drill 0.35)
  Top 0.203: v48.74,71.6 48.74,82.87 49.85,83.98 JMP1.2 | v66.52,81.76 68.58,81.76 R9.1
  Bottom 0.203: v48.74,71.6 50.48,69.85 U$6.M0 55.88,69.85 55.88,75.09 63.18,82.39 65.88,82.39 v66.52,81.76
N$9  (via drill 0.35)
  Top 0.203: LM2623.P$8 21.91,24.13 21.88,24.29
  Top 0.813: U$4.P$2 27.77,24.29 21.88,24.29 21.88,25.2 C7.2 19.52,28.74 19.05,29.21 v17.78,29.21 | L2.P$2 13.92,25.35 v13.97,25.4
  Bottom 0.813: v13.97,25.4 v17.78,29.21
N$10
  Top 0.203: U$6.M1 55.88,68.58 55.88,82.07 53.98,83.98 JMP2.2
N$11  (via drill 0.35)
  Top 0.406: LM2623.P$7 LM2623.P$6 21.85,22.86 v20.54,22.86 | LM2623.P$2 18.68,23.48 18.94,23.73 18.94,24.02 19.05,24.13 20.33,24.13 20.93,23.52 21.84,23.52 LM2623.P$7 | v22.95,21.45 22.95,19.46 22.98,19.43 | LM2623.P$7 22.01,23.35 v23.34,23.35 | v30.48,26.67 30.48,27.56
  Top 0.813: R5.2 30.48,27.56 32.13,27.56 C9.1 | U$4.P$1 22.98,19.43 U$5.P$2
  Bottom 0.406: v20.54,22.86 21.96,21.45 v22.95,21.45 | v23.34,23.35 23.4,23.41 23.4,25.7 24.36,26.67 v30.48,26.67
N$12
  Top 0.203: U$6.M2 53.34,66.04 53.34,72.87 53.82,73.34 53.82,77.15 JMP3.2
N$13
  Top 0.203: 53.82,82.07 53.82,79.06 JMP3.1 | 53.82,82.07 50.01,82.07 JMP1.1 50.01,82.23 52.86,85.09 53.82,85.09 57.47,88.74 66.52,88.74 69.69,85.57 69.69,80.8 68.58,79.69 R8.1 | 53.82,82.07 JMP2.1
N$14
  Top 1.016: U$6.B2 JP1.1
N$15
  Top 1.016: U$6.B1 JP1.2
N$16
  Top 1.016: U$6.A1 JP1.3
N$17
  Top 1.016: U$6.A2 JP1.4
N$19  (via drill 0.35)
  Top 0.203: R12.1 64.61,50.96 54.45,50.96 51.59,48.1 49.69,48.1 JMP4.2 49.53,47.94 48.58,46.99 48.58,45.4 52.55,41.43 v52.55,36.04
  Bottom 0.203: U$7.M0 52.86,36.04 v52.55,36.04
N$20  (via drill 0.35)
  Top 0.203: v52.55,47.94 53.98,47.94 JMP5.2
  Bottom 0.203: v52.55,47.94 42.55,37.94 41.43,37.94 40.48,36.99 40.48,31.43 39.85,30.8 39.85,29.69 52.55,29.69 U$7.M1
N$21
  Top 0.203: U$7.M2 53.34,30.48 53.34,37.31 53.98,37.94 53.98,41.59 JMP6.2
N$22
  Top 0.203: 54.13,43.5 54.13,46.04 JMP5.1 53.98,46.2 49.69,46.2 JMP4.1 | 54.13,43.5 56.52,41.12 68.58,41.12 R11.1 | 54.13,43.5 JMP6.1
N$23
  Top 1.016: U$7.B2 JP2.1
N$24
  Top 1.016: U$7.B1 JP2.2
N$25
  Top 1.016: U$7.A1 JP2.3
N$26
  Top 1.016: JP2.4 U$7.A2
N$27
  Top 0.203: R13.2 30.64,87.63 32.38,85.88 33.02,85.88 34.13,87 34.13,90.01 U$8.3
N$28
  Top 0.203: R14.2 33.02,93.98 U$8.1
N$29
  Top 0.203: U$8.6 43.97,91.44 46.99,88.42 X2.1
N$30
  Top 0.203: U$8.8 43.66,96.52 45.72,98.58 48.42,98.58 51.59,95.41 51.59,91.28 54.45,88.42 X2.3
N$31
  Top 0.203: U$8.5 43.02,88.9 43.02,89.38 41.75,90.65 41.75,92.71 43.02,93.98 U$8.7 46.36,97.16 46.99,97.16 X2.2
N$32
  Top 1.016: VIN.2 7.62,15.24 8.7,14.16 U$2.PIN
N$33
  Top 1.016: VIN.1 8.7,9.08 U$2.PIN2
N$34  (via drill 0.35)
  Top 0.203: 37.97,71.8 37.92,71.8 37.92,71.74 IC1.82 37.78,71.6 37.15,70.96 v36.83,70.96
  Bottom 0.203: v36.83,70.96 40.64,74.77 JP3.1
N$35  (via drill 0.35)
  Top 0.203: v33.5,57.94 33.5,59.21 33.02,59.69 IC1.55
  Bottom 0.203: v33.5,57.94 33.5,56.36 JP4.1
N$36
  Top 0.203: JP5.1 27.62,57.47 27.62,57.94 28.26,58.58 IC1.49
N$37
  Top 0.203: D2.P$1 43.5,21.59 42.39,22.7 40.8,22.7 R15.1
N$38
  Top 0.203: R16.1 D3.P$1
N$39
  Top 0.203: D4.P$1 22.07,41.12 23.81,41.12 24.13,40.8 R17.1
N$40  (via drill 0.35)
  Top 0.203: v30.48,45.09 26.19,40.8 R17.2 | v30.96,59.69 31.59,59.69 32.23,59.05 IC1.53
  Bottom 0.203: v30.48,45.09 30.48,59.21 v30.96,59.69
N$41
  Top 0.61: U$3.P$1 31.8,8.26 LM2594.7
PAN_DIR_D22
  Top 0.203: U$6.DIR 54.61,54.93 46.2,63.34 44.77,63.34 38.74,69.37 38.74,69.85 39.21,70.33 IC1.78
PAN_EN_D23  (via drill 0.35)
  Top 0.203: v42.07,72.39 39.69,70.01 IC1.77
  Bottom 0.203: U$6.EN v42.07,72.39
PAN_STEP_D24
  Top 0.203: U$6.STEP 42.23,69.53 40.16,69.53 IC1.76
RESET  (via drill 0.35)
  Top 0.203: S1.3 24.77,91.6 24.77,86.68 20,81.92 C4.2 19.84,77.47 19.21,76.83 19.21,76.68 18.89,76.36 14.13,76.36 13.18,77.31 5.87,77.31 5.24,76.68 5.24,73.5 | R2.2 6.03,62.87 10.33,58.56 | R1.1 10.33,58.56 | ISP.6 5.4,73.66 5.24,73.5 | 5.24,73.5 3.97,72.23 3.33,72.23 2.38,71.28 2.38,68.42 R2.2 | R2.2 | v20.64,64.45 21.59,65.41 IC1.30 | R1.1 10.27,58.5 10.33,58.56
  Bottom 0.203: v20.64,64.45 20.64,70.48 17.46,73.66 ISP.6
RESET1  (via drill 0.35)
  Top 0.203: U$6.RST U$6.SLP | v56.77,64.5 56.77,76 63.77,83 63.77,87.5 R7.1
  Bottom 0.203: v56.77,64.5 54.77,62.5 U$6.RST
RESET2
  Top 0.203: U$7.SLP U$7.RST 54.77,27 60.77,33 68.27,33 69.77,34.5 69.77,45 68.77,46 68.77,47 R10.1
RSTBT_D49  (via drill 0.35)
  Top 0.203: v27.15,62.55 25.4,64.29 24.13,64.29 23.5,63.66 IC1.35
  Bottom 0.203: v27.15,62.55 27.15,37.62 EXP2.8
RX1
  Top 0.203: IC1.45 26.99,60.17 27.62,60.8 28.26,60.8 31.75,57.31 39.37,57.31 40.01,57.94 42.7,57.94 GPS.4
RX2  (via drill 0.35)
  Top 0.203: v23.5,75.56 24.77,74.3 IC1.12
  Bottom 0.203: v23.5,75.56 23.5,75.09 28.1,70.48 28.1,43.02 AUX.2
RX3  (via drill 0.35)
  Top 0.203: v35.56,58.9 36.99,58.9 37.78,59.69 37.78,60.48 35.72,62.55 IC1.63 | v34.13,38.26 33.18,37.31 33.18,35.4 AUX.1
  Bottom 0.203: v35.56,58.9 34.13,57.47 v34.13,38.26
SCL  (via drill 0.35)
  Top 0.203: v31.75,61.91 27.3,61.91 26.19,60.8 IC1.43
  Bottom 0.203: v31.75,61.91 32.23,61.44 46.2,61.44 GPS.6
SDA  (via drill 0.35)
  Top 0.203: v30.96,61.28 27.46,61.28 26.67,60.48 IC1.44 | v37.15,60.01 v35.56,60.01
  Bottom 0.203: v30.96,61.28 31.75,61.28 33.02,60.01 v35.56,60.01 | v37.15,60.01 44.29,60.01 44.45,59.85 GPS.5
SHUTTER_D32  (via drill 0.35)
  Top 0.203: v32.7,62.07 33.97,60.8 IC1.58 | v32.7,86.68 32.7,87.63 R14.1
  Bottom 0.203: v32.7,86.68 v32.7,62.07
TILT_DIR_D26  (via drill 0.35)
  Top 0.203: v48.1,55.24 48.1,57.94 39.69,66.36 IC1.74 | v37.94,45.09 37.94,33.81 v36.99,32.86
  Bottom 0.203: v37.94,45.09 v48.1,55.24 | v36.99,32.86 36.99,31.27 49.21,19.05 U$7.DIR
TILT_EN_D27  (via drill 0.35)
  Top 0.203: v51.75,37.15 48.1,40.8 48.1,54.29 42.86,59.53 42.86,62.55 39.37,66.04 IC1.73
  Bottom 0.203: v51.75,37.15 52.07,36.83 U$7.EN
TILT_STEP_D28  (via drill 0.35)
  Top 0.203: v37.94,66.83 38.89,65.88 IC1.72
  Bottom 0.203: v37.94,66.83 45.88,66.83 54.45,58.26 67.79,58.26 68.42,57.63 68.42,53.66 63.34,48.58 49.53,48.58 38.26,37.31 38.26,30.64 47.31,21.59 U$7.STEP
TX1
  Top 0.203: IC1.46 27.3,59.69 27.94,60.33 28.1,60.33 31.91,56.52 31.91,55.4 32.54,54.77 36.99,54.77 38.42,56.2 40.96,56.2 GPS.3
TX2  (via drill 0.35)
  Top 0.203: v23.18,74.45 23.81,74.45 24.45,73.82 IC1.13
  Bottom 0.203: v23.18,74.45 23.18,62.71 25.24,60.64 25.24,38.26 24.29,37.31 24.29,33.81 24.92,33.18 31.59,33.18 34.13,35.72 35.72,35.72 AUX.4
TX3  (via drill 0.35)
  Top 0.203: v35.56,57.94 36.67,57.94 38.42,59.69 38.42,60.64 36.2,62.87 IC1.64 | v35.56,37.47 35.56,35.56 AUX.3
  Bottom 0.203: v35.56,37.47 v35.56,57.94
USBRX  (via drill 0.35)
  Top 0.203: v22.38,83.03 27.94,77.47 IC1.3
  Top 0.254: USB.3 12.7,90.53 14.36,92.19 14.36,95.77 13.22,96.91 11.64,96.91 11.45,96.72 11.45,96.3 CP2102.25 | TP7.TP 12.32,83.82 v11.54,83.82
  Bottom 0.203: v22.38,83.03 12.38,83.03 11.59,83.82 v11.54,83.82
  Bottom 0.254: v11.54,83.82 11.54,85.2 USB.3
USBTX  (via drill 0.35)
  Top 0.203: v23.5,84.45 23.5,82.55 28.26,77.79 IC1.2
  Top 0.254: v13.97,90.17 13.97,91.16 14.82,92 14.82,95.96 13.41,97.37 11.45,97.37 10.95,96.86 10.95,96.3 CP2102.26 | TP6.TP USB.2
  Bottom 0.203: v23.5,84.45 23.5,85.41 18.89,90.01 13.97,90.01 v13.97,90.17
  Bottom 0.254: v13.97,90.17 USB.2
USBV  (via drill 0.35)
  Top 0.203: C6.1 18.41,91.12 U$1.P$2
  Top 0.254: v5.14,90.17 5.48,90.51 7.96,90.51 8.89,91.44 8.89,92.48 CP2102.7 CP2102.8 9.95,91.66 9.95,90.65 11.61,88.99 11.61,85.15 12.25,84.51 15.69,84.51 17.55,86.36 USB.5 17.78,90.56 U$1.P$2 | U1.VBUS1 6.54,95.25 7.62,95.25 7.62,96.52 5.53,98.61 v5.14,98.61 | TP8.TP 18.16,83.82 v19.05,83.82
  Bottom 0.254: v5.14,98.61 5.14,97.88 4.71,97.45 2.82,97.45 1.27,95.9 1.27,91.44 2.54,90.17 v5.14,90.17 | v19.05,83.82 19.05,85.09 USB.5
VIN  (via drill 0.35)
  Top 0.813: v40.64,30.48 39.69,29.53 R16.2 36.83,23.81 v36.83,21.59 | v31.75,13.97 31.75,11.46 31.72,11.43
  Top 1.016: U$5.P$1 18.54,18.29 v19.05,17.78 | v12.7,12.7 12.7,7.62 U$2.P+ 17.43,6.39 C10.+ 25.4,8.93 25.4,11.43 31.72,11.43 U$3.P$2
  Bottom 0.203: 71.12,45.72 C11.+ | C12.+ 63.5,81.28 63.5,72.71 67.15,72.71 U$6.VMOT
  Bottom 0.813: v40.64,30.48 48.44,38.28 55.21,38.28 56.66,36.83 U$7.VMOT 71.12,36.83 71.12,45.72 71.12,58.26 70.26,59.12 70.26,69.44 U$6.VMOT | v36.83,21.59 31.75,16.51 v31.75,13.97
  Bottom 1.016: v19.05,17.78 17.78,17.78 v12.7,12.7
XTAL1
  Top 0.203: TP1.TP C1.2 24.92,50.8 24.92,53.66 23.5,55.09 | 23.5,55.09 23.02,55.56 X1.1 23.5,55.09 | 23.5,55.09 17.3,55.09 16.99,55.4 16.99,56.04 20,59.05 20,60.96 23.02,63.98 IC1.34
XTAL2
  Top 0.152: C2.2 15.62,64.77 16.51,64.77 16.51,65.15 TP2.TP
  Top 0.203: 16.51,63.66 16.51,61.91 16.83,61.59 X1.2 | 16.51,63.66 16.51,64.77 | 16.51,63.66 22.07,63.66 22.7,64.29 IC1.33
(copper drawn outside any net)
  shapes: Top area x2

### Text on the board
tNames: DTR | VUSB | URX | UTX | # | SCL | SDA | RX | TX | +5V | GND | BOOT | 5v | GND | 12V | 5V | Panobot-V2 Daniel Zollitsch